# Altium schematic sheet Sheet_1.schdoc
size 315 x 223 mm
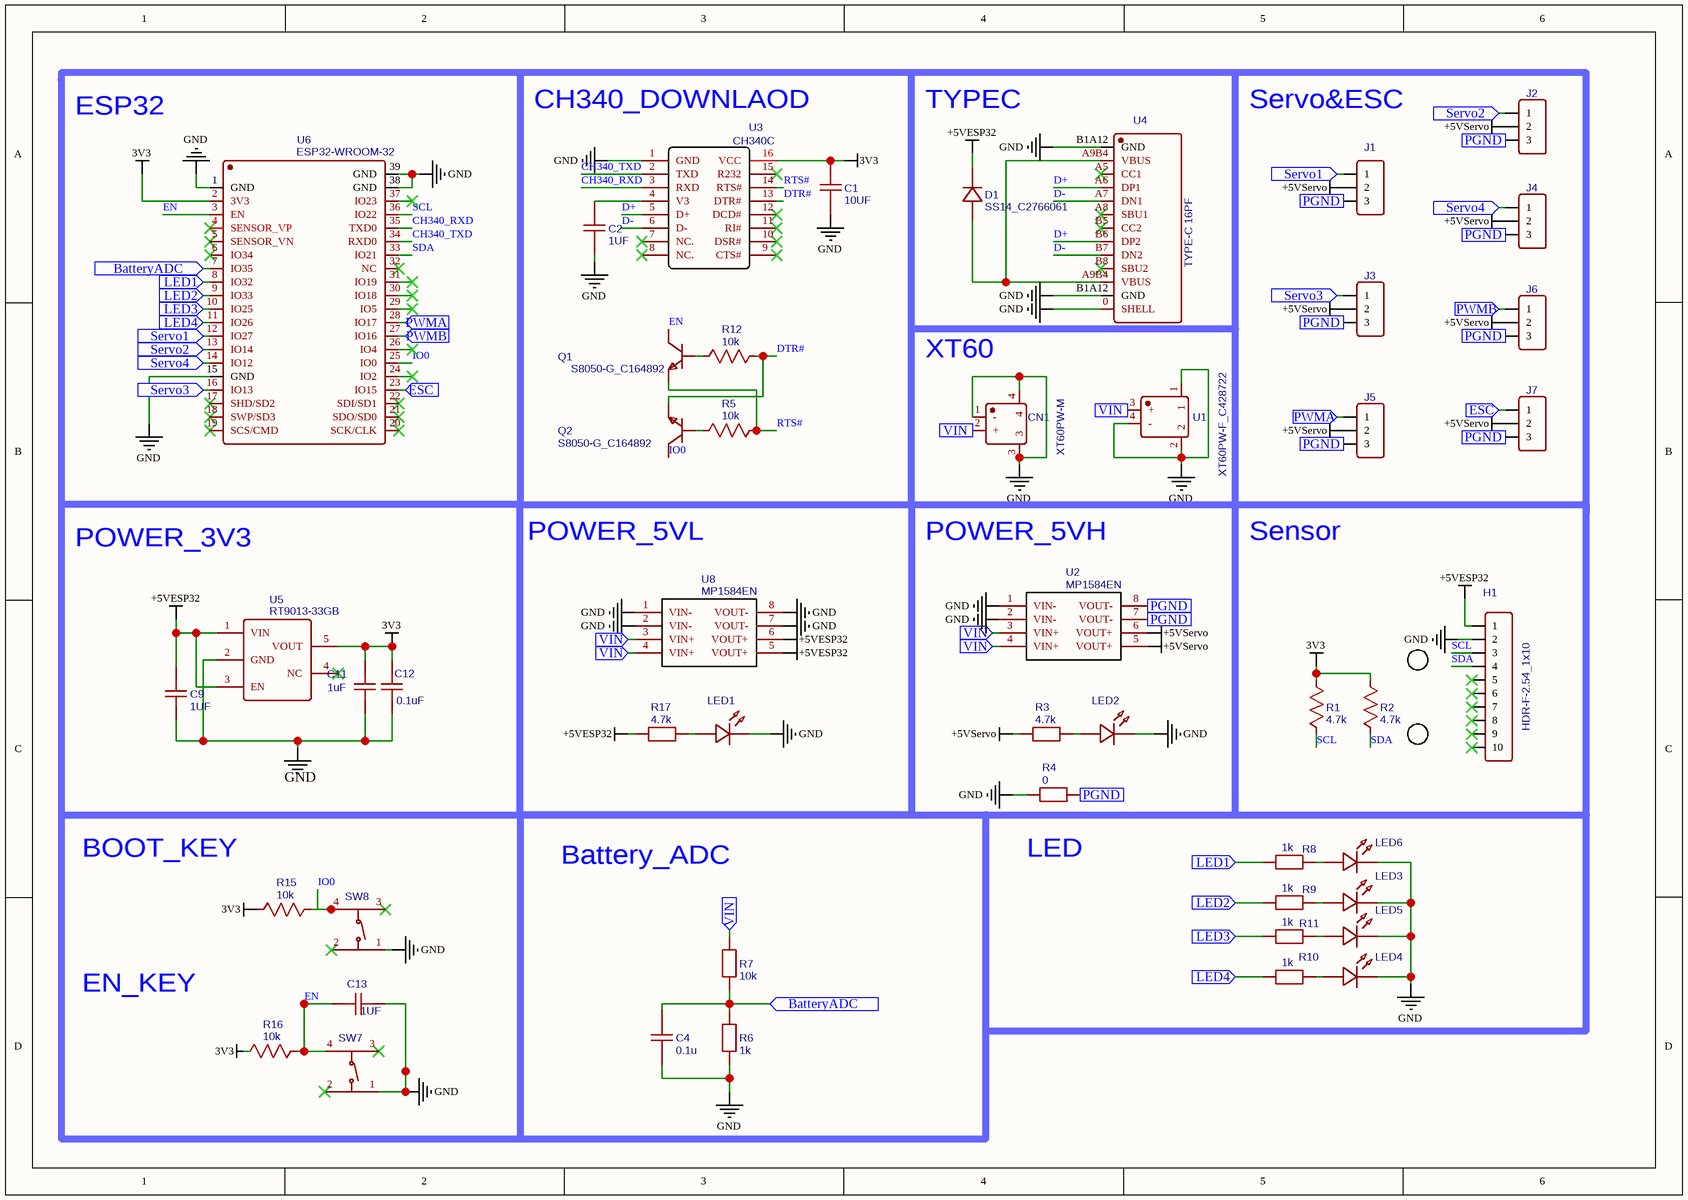
[diagram p0: Sheet_1.schdoc]

## Parts
C1  10UF  [C0805]
C2  1UF  [C0805]
C4  0.1u  [C0805]
C9  1UF  [C0805]
C11  1uF  [C0805]
C12  0.1uF  [C0805]
C13  1UF  [C0805]
CN1  XT60PW-M  [CONN-TH_XT60PW-M]
D1  SS14_C2766061  [SMA_L4.3-W2.7-LS5.1-RD]
H1  HDR-F-2.54_1x10  [HDR-F-2.54_1X10]
J1  HDR-M-2.54_1x3  [HDR-M-2.54_1X3]  (value not drawn)
J2  HDR-M-2.54_1x3  [HDR-M-2.54_1X3]  (value not drawn)
J3  HDR-M-2.54_1x3  [HDR-M-2.54_1X3]  (value not drawn)
J4  HDR-M-2.54_1x3  [HDR-M-2.54_1X3]  (value not drawn)
J5  HDR-M-2.54_1x3  [HDR-M-2.54_1X3]  (value not drawn)
J6  HDR-M-2.54_1x3  [HDR-M-2.54_1X3]  (value not drawn)
J7  HDR-M-2.54_1x3  [HDR-M-2.54_1X3]  (value not drawn)
LED1  LED-0805_R  [LED0805_RED]  (value not drawn)
LED2  LED-0805_R  [LED0805_RED]  (value not drawn)
LED3  LED-0805_R  [LED0805_RED]  (value not drawn)
LED4  LED-0805_R  [LED0805_RED]  (value not drawn)
LED5  LED-0805_R  [LED0805_RED]  (value not drawn)
LED6  LED-0805_R  [LED0805_RED]  (value not drawn)
Q1  S8050-G_C164892  [SOT-23-3_L2.9-W1.3-P1.90-LS2.4-BR]
Q2  S8050-G_C164892  [SOT-23-3_L2.9-W1.3-P1.90-LS2.4-BR]
R1  4.7k  [R0805]
R2  4.7k  [R0805]
R3  4.7k  [R0805]
R4  0  [R0805]
R5  10k  [R0805]
R6  1k  [R0805]
R7  10k  [R0805]
R8  1k  [R0805]
R9  1k  [R0805]
R10  1k  [R0805]
R11  1k  [R0805]
R12  10k  [R0805]
R15  10k  [R0805]
R16  10k  [R0805]
R17  4.7k  [R0805]
SW7  3*4*2.5MM 贴片4脚  [SW-SMD_4P-L4.2-W3.3-P2.15-LS5.1]  (value not drawn)
SW8  3*4*2.5MM 贴片4脚  [SW-SMD_4P-L4.2-W3.3-P2.15-LS5.1]  (value not drawn)
U1  XT60PW-F_C428722  [TH_2P-XT60PW-F]
U2  MP1584EN  [MP1584EN]
U3  CH340C  [SOP-16_L10.0-W3.9-P1.27-LS6.0-BL]
U4  TYPE-C 16PF  [USB-C-SMD_TYPE-C-USB-5]
U5  RT9013-33GB  [SOT-23-5_L3.0-W1.7-P0.95-LS2.8-BL]
U6  ESP32-WROOM-32  [WIFIM-SMD_ESP32-WROOM-32-N4]
U8  MP1584EN  [MP1584EN]

## Ports
BatteryADC (in), ESC (in), LED1 (in), LED2 (in), LED3 (in), LED4 (in), PGND (in), PWMA (in), PWMB (in), Servo1 (in), Servo2 (in), Servo3 (in), Servo4 (in), VIN (in)

## Nets
3V3: C1.2 C11.2 C12.2 R1.1 R2.1 R15.2 R16.2 U3.16(VCC) U5.5(VOUT) U6.2(3V3)
+5VESP32: C9.1 D1.1(K) H1.1 R17.1 U5.1(VIN) U5.3(EN) U8.5(VOUT+) U8.6(VOUT+)
+5VServo: J1.2 J2.2 J3.2 J4.2 J5.2 J6.2 J7.2 R3.1 U2.5(VOUT+) U2.6(VOUT+)
GND: C1.1 C2.1 C4.1 C9.2 C11.1 C12.1 C13.1 CN1.1(-) CN1.3 CN1.4 H1.2 LED1.2 LED2.2 LED3.2 LED4.2 LED5.2 LED6.2 R4.1 R6.1 SW7.1 SW8.1 U1.1 U1.2 U1.4(-) U2.1(VIN-) U2.2(VIN-) U3.1(GND) U4.0(SHELL) U4.B1A12(GND) U5.2(GND) U6.1(GND) U6.15(GND) U6.38(GND) U6.39(GND) U8.1(VIN-) U8.2(VIN-) U8.7(VOUT-) U8.8(VOUT-)
BatteryADC: C4.2 R6.2 R7.1 U6.7(IO35) ; port BatteryADC
CH340_RXD: U3.3(RXD) U6.35(TXD0)
CH340_TXD: U3.2(TXD) U6.34(RXD0)
D+: U3.5(D+) U4.A6(DP1) U4.B6(DP2)
D-: U3.6(D-) U4.A7(DN1) U4.B7(DN2)
DTR#: Q2.2(E) R12.1 U3.13(DTR#)
EN: C13.2 Q1.3(C) R16.1 SW7.4 U6.3(EN)
ESC: J7.1 U6.23(IO15) ; port ESC
IO0: Q2.3(C) R15.1 SW8.4 U6.25(IO0)
LED1: R8.2 U6.8(IO32) ; port LED1
LED2: R9.2 U6.9(IO33) ; port LED2
LED3: R11.2 U6.10(IO25) ; port LED3
LED4: R10.2 U6.11(IO26) ; port LED4
PGND: J1.3 J2.3 J3.3 J4.3 J5.3 J6.3 J7.3 R4.2 U2.7(VOUT-) U2.8(VOUT-) ; port PGND
PWMA: J5.1 U6.28(IO17) ; port PWMA
PWMB: J6.1 U6.27(IO16) ; port PWMB
RTS#: Q1.2(E) R5.1 U3.14(RTS#)
SCL: H1.3 R1.2 U6.36(IO22)
SDA: H1.4 R2.2 U6.33(IO21)
Servo1: J1.1 U6.12(IO27) ; port Servo1
Servo2: J2.1 U6.13(IO14) ; port Servo2
Servo3: J3.1 U6.16(IO13) ; port Servo3
Servo4: J4.1 U6.14(IO12) ; port Servo4
VIN: CN1.2(+) R7.2 U1.3(+) U2.3(VIN+) U2.4(VIN+) U8.3(VIN+) U8.4(VIN+) ; port VIN
NetC2_2: C2.2 U3.4(V3)
NetD1_2: D1.2(A) U4.A9B4(VBUS)
NetLED1_1: LED1.1 R17.2
NetLED2_1: LED2.1 R3.2
NetLED3_1: LED3.1 R9.1
NetLED4_1: LED4.1 R10.1
NetLED5_1: LED5.1 R11.1
NetLED6_1: LED6.1 R8.1
NetQ1_1: Q1.1(B) R12.2
NetQ2_1: Q2.1(B) R5.2

Not connected (* = marked no-connect by the designer): H1 5* 6* 7* 8* 9* 10*; SW7 2* 3*; SW8 2* 3*; U3 7(NC.)* 8(NC.)* 9(CTS#)* 10(DSR#)* 11(RI#)* 12(DCD#)* 15(R232)*; U4 A5(CC1)* A8(SBU1)* B5(CC2)* B8(SBU2)*; U5 4(NC)*; U6 4(SENSOR_VP)* 5(SENSOR_VN)* 6(IO34)* 17(SHD/SD2)* 18(SWP/SD3)* 19(SCS/CMD)* 20(SCK/CLK)* 21(SDO/SD0)* 22(SDI/SD1)* 24(IO2)* 26(IO4)* 29(IO5)* 30(IO18)* 31(IO19)* 32(NC)* 37(IO23)*

## Notes on the sheet
- ESP32
- (near U3) CH340_DOWNLAOD
- TYPEC
- Servo&ESC
- (near CN1) XT60
- POWER_5VL
- POWER_5VH
- Sensor
- POWER_3V3
- GND
- BOOT_KEY
- Battery_ADC
- (near R4) LED
- EN_KEY

## Library data of the parts
C1 = 10UF: nameAlias: Value(F); Contributor: LCEDA_Lib; spicePre: C; spiceSymbolName: C_0603_US
C2 C9 C13 = 1UF: nameAlias: Value(F); Contributor: LCEDA_Lib; spicePre: C; spiceSymbolName: C_0603_US
C4 = 0.1u: nameAlias: Value(F); Contributor: LCEDA_Lib; spicePre: C; spiceSymbolName: C_0805_US
C11 = 1uF: nameAlias: Value(F); Contributor: LCEDA_Lib; spicePre: C; spiceSymbolName: C_0805_US
C12 = 0.1uF: nameAlias: Value(F); Contributor: LCEDA_Lib; spicePre: C; spiceSymbolName: C_0805_US
CN1 = XT60PW-M: Manufacturer: AMASS(艾迈斯); Contributor: LCSC; Supplier: LCSC; Supplier Part: C98732; Manufacturer Part: XT60PW-M; JLCPCB Part Class: Extended Part; spicePre: C; spiceSymbolName: XT60PW-M
D1 = SS14_C2766061: Manufacturer: WPMtek(维攀微); Contributor: LCSC; Supplier: LCSC; Supplier Part: C2766061; JLCPCB Part Class: Extended Part; spicePre: D; spiceSymbolName: SS14_C2766061
H1 = HDR-F-2.54_1x10: Contributor: LCEDA_Lib; Supplier Part: C35445; Supplier: LCSC; spicePre: H; spiceSymbolName: HDR-F-2.54_1x10
J1-J7 = HDR-M-2.54_1x3: Contributor: LCEDA_Lib; Supplier Part: C180248; Supplier: LCSC; spicePre: J; spiceSymbolName: HDR-M-2.54_1x3
LED1-LED6 = LED-0805_R: Manufacturer: EVERLIGHT(台湾亿光); Manufacturer Part: 17-21SURC/S530-A3/TR8; Contributor: LCEDA_Lib; Supplier Part: C72037; spicePre: L; spiceSymbolName: LED-0805_R
Q1 Q2 = S8050-G_C164892: Manufacturer: CJ(江苏长电/长晶); Contributor: 立创EDA官方封装库; Supplier: LCSC; Supplier Part: C164892; Manufacturer Part: S8050-G; JLCPCB Part Class: Extended Part; spicePre: Q; spiceSymbolName: S8050-G_C164892
R1-R3 R17 = 4.7k: nameAlias: Value(Ω); Contributor: LCEDA_Lib; spicePre: R
  R1 R2: spiceSymbolName: R_0603_US
  R3 R17: spiceSymbolName: R_0805_EU
R4 = 0: nameAlias: Value(Ω); Contributor: LCEDA_Lib; spicePre: R; spiceSymbolName: R_0805_EU
R5 R7 R12 R15 R16 = 10k: nameAlias: Value(Ω); Contributor: LCEDA_Lib; spicePre: R
  R5 R12 R15 R16: spiceSymbolName: R_0603_US
  R7: spiceSymbolName: R_0805_EU
R6 R8-R11 = 1k: nameAlias: Value(Ω); Contributor: LCEDA_Lib; spicePre: R; spiceSymbolName: R_0805_EU
SW7 SW8 = 3*4*2.5MM 贴片4脚: Manufacturer: null; Contributor: lcsc; Supplier: LCSC; Supplier Part: C9900020788; JLCPCB Part Class: Extended Part; spicePre: S; spiceSymbolName: 3*4*2.5MM 贴片4脚
U1 = XT60PW-F_C428722: Manufacturer: AMASS(艾迈斯); Contributor: lcsc; Supplier: LCSC; Supplier Part: C428722; Manufacturer Part: XT60PW-F; JLCPCB Part Class: Extended Part; spicePre: U; spiceSymbolName: XT60PW-F_C428722
U2 U8 = MP1584EN: Contributor: 1234455j; spicePre: U; spiceSymbolName: MP1584EN-LF-Z
U3 = CH340C: Manufacturer: WCH(南京沁恒); Supplier: LCSC; Manufacturer Part: CH340C; Supplier Part: C84681; JLCPCB Part Class: Extended Part; spicePre: U; spiceSymbolName: CH340C
U4 = TYPE-C 16PF: Manufacturer: null; Contributor: LCSC; Supplier: LCSC; Supplier Part: C2835121; Manufacturer Part: TYPE-C 16PF; JLCPCB Part Class: Extended Part; spicePre: U; spiceSymbolName: TYPE-C 16PF
U5 = RT9013-33GB: Manufacturer: RICHTEK(立锜); Supplier: LCSC; Supplier Part: C47773; JLCPCB Part Class: Extended Part; spicePre: U; spiceSymbolName: RT9013-33GB
U6 = ESP32-WROOM-32: Manufacturer: ESPRESSIF(乐鑫); Manufacturer Part: ESP32-WROOM-32-N4; Contributor: LCSC; Supplier: LCSC; Supplier Part: C82899; JLCPCB Part Class: Extended Part; spicePre: U; spiceSymbolName: ESP32-WROOM-32